# EAGLE design EZLink_SIL_8051_443x (EAGLE 4.16)
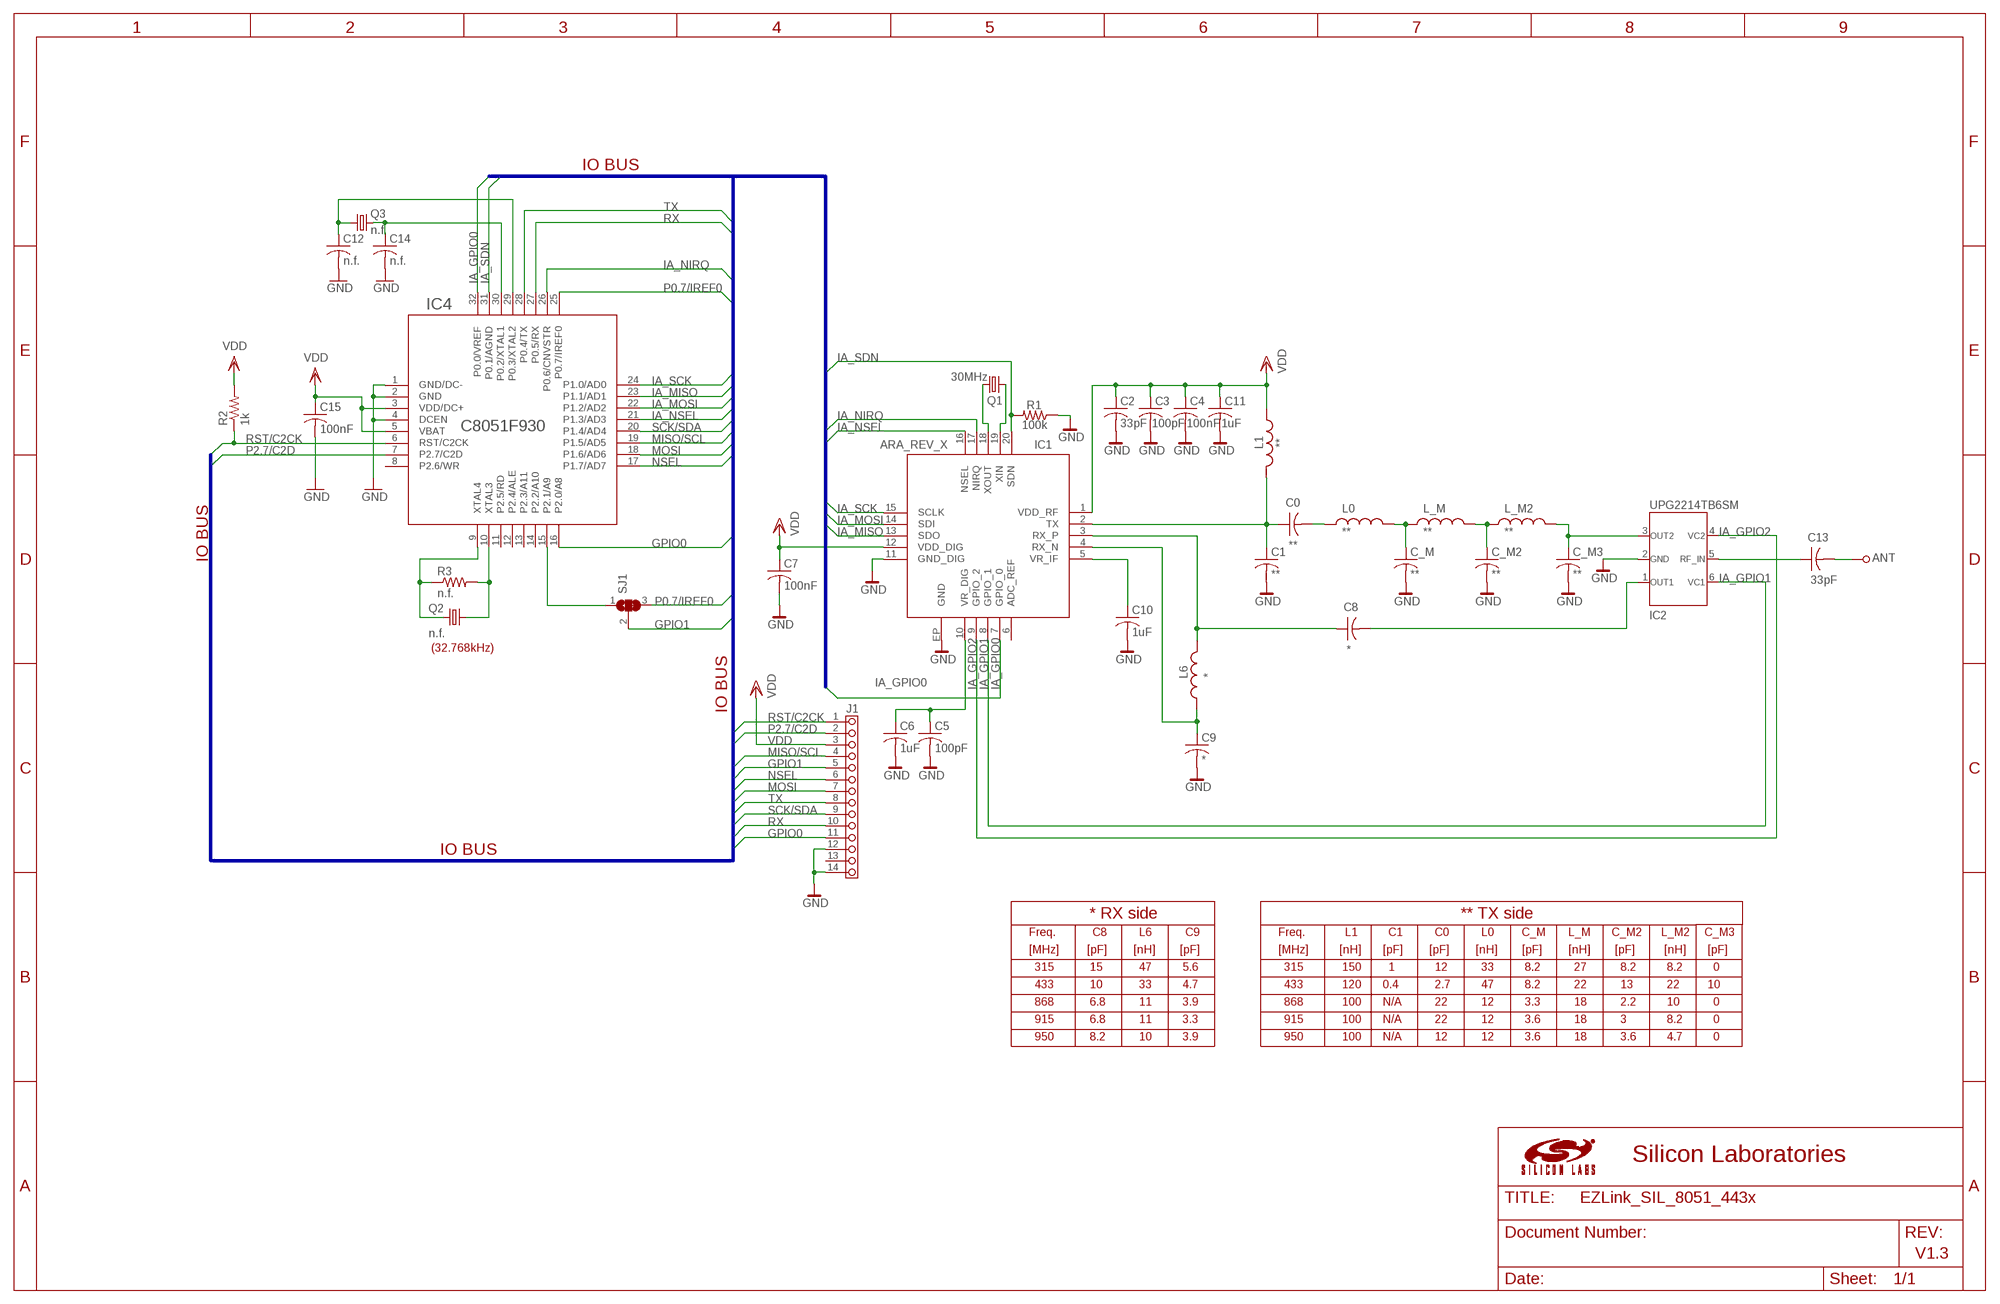
[diagram p0: schematic, sheet 1]

## Parts
ANT  TESTPOINT32MIL  [TESTPOINT0,8]
C0  **  C-US-SMD0402  [0402]
C1  **  C-US-SMD0402  [0402]
C2  33pF  C-USC0603K  [C0603K]
C3  100pF  C-USC0603K  [C0603K]
C4  100nF  C-USC0603K  [C0603K]
C5  100pF  C-USC0603K  [C0603K]
C6  1uF  C-USC0603K  [C0603K]
C7  100nF  C-USC0603K  [C0603K]
C8  *  C-US-SMD0402  [0402]
C9  *  C-US-SMD0402  [0402]
C10  1uF  C-USC0603K  [C0603K]
C11  1uF  C-USC0603K  [C0603K]
C12  n.f.  C-USC0603K  [C0603K]
C13  33pF  C-US-SMD0402  [0402]
C14  n.f.  C-USC0603K  [C0603K]
C15  100nF  C-USC0603K  [C0603K]
C_M  **  C-US-SMD0402  [0402]
C_M2  **  C-US-SMD0402  [0402]
C_M3  **  C-US-SMD0402  [0402]
IC1  ARA_REV_X  [QFN-20]
IC2  UPG2214TB6SM  [6-PIN_SUPER_MINIMOLD]
IC4  C8051F930  C8051F9309DRILL  [QFN-32-5X5-1]
J1  PIN14S-2MM  [PIN14S_2MM]
L0  **  INDUCTCOILCRAFT-0402  [L1005]
L1  **  INDUCTCOILCRAFT-0603  [L1608]
L6  *  INDUCTCOILCRAFT-0402  [L1005]
L_M  **  INDUCTCOILCRAFT-0402  [L1005]
L_M2  **  INDUCTCOILCRAFT-0402  [L1005]
Q1  30MHz  CRYSTAL-4PINSX-2520-NEW1  [QUARTZ_SIWARD_2520_NEW1]
Q2  n.f.  CRYSTAL32SL  [SMQ32SL]
Q3  n.f.  CRYSTAL-4PINSX-5032_NEW  [QUARTZ_SIWARD_5032_NEW]
R1  100k  R-US_R0603  [R0603]
R2  1k  R-US_R0603  [R0603]
R3  n.f.  R-US_R0603  [R0603]
SJ1  JUMPER_SMD_3A  [JUMPER_SMD_SJ2A]

## Nets
GND: C1.2 C2.2 C3.2 C4.2 C5.2 C6.2 C7.2 C9.2 C10.2 C11.2 C12.2 C14.2 C15.2 C_M2.2 C_M3.2 C_M.2 IC1.11(GND_DIG) IC1.EP(GND) IC2.2 IC4.1(GND/DC-) IC4.2(GND) IC4.4(DCEN) J1.12 J1.14 R1.1
GPIO0: IC4.16(P2.0/A8) J1.11
GPIO1: J1.5 SJ1.2
IA_GPIO0: IC1.7(GPIO_0) IC4.32(P0.0/VREF)
IA_GPIO1: IC1.8(GPIO_1) IC2.6
IA_GPIO2: IC1.9(GPIO_2) IC2.4
IA_MISO: IC1.13(SDO) IC4.23(P1.1/AD1)
IA_MOSI: IC1.14(SDI) IC4.22(P1.2/AD2)
IA_NIRQ: IC1.17(NIRQ) IC4.26(P0.6/CNVSTR)
IA_NSEL: IC1.16(NSEL) IC4.21(P1.3/AD3)
IA_SCK: IC1.15(SCLK) IC4.24(P1.0/AD0)
IA_SDN: IC1.20(SDN) IC4.31(P0.1/AGND) R1.2
MISO/SCL: IC4.19(P1.5/AD5) J1.4
MOSI: IC4.18(P1.6/AD6) J1.7
N$1: IC1.18(XOUT) Q1.1
N$2: C10.1 IC1.5(VR_IF)
N$3: C0.1 C1.1 IC1.2(TX) L1.2
N$4: C0.2 L0.1
N$5: C_M.1 L0.2 L_M.1
N$6: C_M2.1 L_M2.1 L_M.2
N$7: C_M3.1 IC2.3 L_M2.2
N$8: C8.1 IC1.3(RX_P) L6.2
N$9: C9.1 IC1.4(RX_N) L6.1
N$10: C8.2 IC2.1
N$11: C13.1 IC2.5
N$16: C5.1 C6.1 IC1.10(VR_DIG)
N$18: ANT.1 C13.2
N$53: IC4.10(XTAL3) Q2.4 R3.2
N$57: IC4.9(XTAL4) Q2.1 R3.1
N$63: C12.1 IC4.29(P0.3/XTAL2) Q3.1
N$66: C14.1 IC4.30(P0.2/XTAL1) Q3.3
N$67: IC4.15(P2.1/A9) SJ1.1
NSEL: IC4.17(P1.7/AD7) J1.6
P0.7/IREF0: IC4.25(P0.7/IREF0) SJ1.3
P2.7/C2D: IC4.7(P2.7/C2D) J1.2
RST/C2CK: IC4.6(RST/C2CK) J1.1 R2.1
RX: IC4.27(P0.5/RX) J1.10
SCK/SDA: IC4.20(P1.4/AD4) J1.9
TX: IC4.28(P0.4/TX) J1.8
VDD: C2.1 C3.1 C4.1 C7.1 C11.1 C15.1 IC1.1(VDD_RF) IC1.12(VDD_DIG) IC4.3(VDD/DC+) IC4.5(VBAT) J1.3 L1.1 R2.2
XIN: IC1.19(XIN) Q1.3
Unconnected: IC1.6(ADC_REF) IC4.8(P2.6/WR) IC4.11(P2.5/RD) IC4.12(P2.4/ALE) IC4.13(P2.3/A11) IC4.14(P2.2/A10) J1.13

## Buses
RX,TX,GPIO1,GPIO0,NSEL,MOSI,MISO/SCL,SCK/SDA,P0.7/IREF0,RST/C2CK,P2.7/C2D,IA_MOSI,IA_SCK,IA_NSEL,IA_MISO,IA_NIRQ,IA_SDN

## Notes on the sheet
- IO BUS
- IO BUS
- (32.768kHz)
- IO BUS
- IO BUS
- * RX side | ** TX side
- Freq. | C8 | L6 | C9 | Freq. | L1 | C1 | C0 | L0 | C_M | L_M | C_M2 | L_M2 | C_M3
- [MHz] | [pF] | [nH] | [pF] | [MHz] | [nH] | [pF] | [pF] | [nH] | [pF] | [nH] | [pF] | [nH] | [pF]
- 315 | 15 | 47 | 5.6 | 315 | 150 | 1 | 12 | 33 | 8.2 | 27 | 8.2 | 8.2 | 0
- 433 | 10 | 33 | 4.7 | 433 | 120 | 0.4 | 2.7 | 47 | 8.2 | 22 | 13 | 22 | 10
- 868 | 6.8 | 11 | 3.9 | 868 | 100 | N/A | 22 | 12 | 3.3 | 18 | 2.2 | 10 | 0
- 915 | 6.8 | 11 | 3.3 | 915 | 100 | N/A | 22 | 12 | 3.6 | 18 | 3 | 8.2 | 0
- 950 | 8.2 | 10 | 3.9 | 950 | 100 | N/A | 12 | 12 | 3.6 | 18 | 3.6 | 4.7 | 0
- Silicon Laboratories
- V1.3

## Power pins joined to a net without a drawn wire
GND: IC4.EP1(GND) IC4.EP2(GND) IC4.EP3(GND) IC4.EP4(GND) IC4.EP5(GND) IC4.EP6(GND) IC4.EP7(GND) IC4.EP8(GND) IC4.EP(GND) Q1.2(GND) Q1.4(GND) Q3.2(GND) Q3.4(GND)

## Library data of the parts
ANT = lve:TESTPOINT
C0 C1 C8 C9 C13 C_M C_M2 C_M3 = lve:C-US-SMD
C2-C7 C10-C12 C14 C15 = rcl:C-US: CAPACITOR, American symbol
IC1 = lve:ARA_REV_X
IC2 = lve:UPG2214TB
IC4 = lve:C8051F930
J1 = lve:PIN14S
L0 L1 L6 L_M L_M2 = lve:INDUCT
Q1 Q3 = lve:CRYSTAL-4PIN
Q2 = lve:CRYSTAL
R1-R3 = rcl:R-US_: RESISTOR, American symbol
SJ1 = lve:JUMPER_SMD_3A

## Board
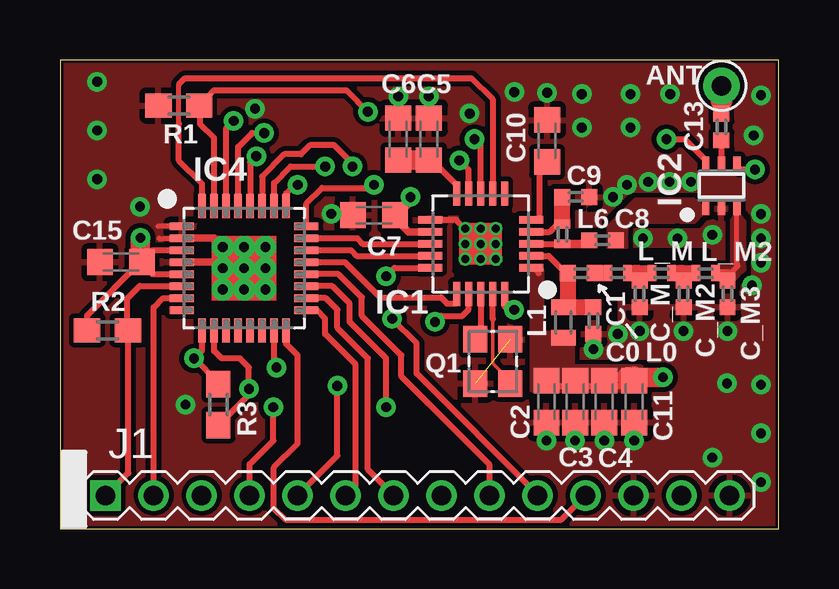
[diagram p1: board, top side]
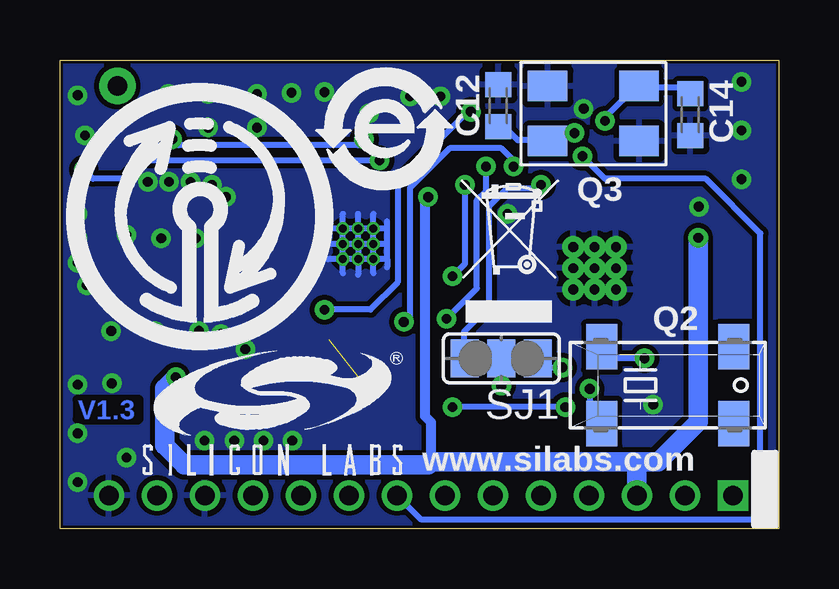
[diagram p2: board, bottom side, seen from below]

Size 29.95 x 19.56 mm. Coordinates in mm from the lower left corner, seen from the top.
Outline: 0,0 29.95,0 29.95,19.56 0,19.56 0,0
Copper layers (1*16): Top 0.035mm / dielectric 1.5mm / Bottom 0.035mm
Design rules "default": minimum track width 8mil, minimum drill 13mil, track to track 8mil, track to pad 8mil, pad to pad 8mil, via to via 8mil, smd to smd 0mil, copper to edge 5mil, drill to drill 8mil, minimum pad ring 4mil, minimum via ring 8mil, stop-mask expansion 4mil, vias tented up to drill 50mil, thermal gap 10mil
tRestrict: 16 lines

### Footprints (pad centres in the part's own frame; a part is rotated, then mirrored left to right if it is on the bottom)
TESTPOINT0,8 = drill 0.813 pad 1.524 round: 1 0,0
0402 = smd 0.66 x 0.66: 1 -0.559,0; 2 0.559,0
C0603K = smd 1.05 x 1.08: 1 -0.875,0; 2 0.875,0
QFN-20 = smd 1 x 0.3: 1 -2.1,1; 2 -2.1,0.5; 3 -2.1,0; 4 -2.1,-0.5; 5 -2.1,-1; 11 2.1,-1; 12 2.1,-0.5; 13 2.1,0; 14 2.1,0.5; 15 2.1,1 | smd 0.3 x 1: 6 -1,-2.1; 7 -0.5,-2.1; 8 0,-2.1; 9 0.5,-2.1; 10 1,-2.1; 16 1,2.1; 17 0.5,2.1; 18 0,2.1; 19 -0.5,2.1; 20 -1,2.1 | drill 0.33 pad 0.508 round: EP 0,0; EP1 -0.635,-0.635; EP2 0,-0.635; EP3 0.635,-0.635; EP4 -0.635,0; EP5 0.635,0; EP7 0,0.635; EP8 0.635,0.635 | drill 0.33 pad 0.508 octagon: EP6 -0.635,0.635
6-PIN_SUPER_MINIMOLD = smd 0.55 x 0.3: 1 -0.948,0.65; 2 -0.948,0; 3 -0.948,-0.65; 4 0.948,-0.65; 5 0.948,0; 6 0.948,0.65
QFN-32-5X5-1 = smd 1 x 0.3: 1 -2.6,1.75; 2 -2.6,1.25; 3 -2.6,0.75; 4 -2.6,0.25; 5 -2.6,-0.25; 6 -2.6,-0.75; 7 -2.6,-1.25; 8 -2.6,-1.75; 17 2.6,-1.75; 18 2.6,-1.25; 19 2.6,-0.75; 20 2.6,-0.25; 21 2.6,0.25; 22 2.6,0.75; 23 2.6,1.25; 24 2.6,1.75 | smd 0.3 x 1: 9 -1.75,-2.6; 10 -1.25,-2.6; 11 -0.75,-2.6; 12 -0.25,-2.6; 13 0.25,-2.6; 14 0.75,-2.6; 15 1.25,-2.6; 16 1.75,-2.6; 25 1.75,2.6; 26 1.25,2.6; 27 0.75,2.6; 28 0.25,2.6; 29 -0.25,2.6; 30 -0.75,2.6; 31 -1.25,2.6; 32 -1.75,2.6 | drill 0.406 pad 0.914 round: EP 0,0; EP1 -0.889,0.889; EP2 0,0.889; EP3 0.889,0.889; EP4 -0.889,0; EP5 0.889,0; EP6 -0.889,-0.889; EP7 0,-0.889; EP8 0.889,-0.889
PIN14S_2MM = drill 0.813 pad 1.27 square: 1 0,0 | drill 0.813 pad 1.27 round: 2 2,0; 3 4,0; 4 6,0; 5 8,0; 6 10,0; 7 12,0; 8 14,0; 9 16,0; 10 18,0; 11 20,0; 12 22,0; 13 24,0; 14 26,0
L1005 = smd 0.356 x 0.66: 1 -0.406,0; 2 0.406,0
L1608 = smd 0.64 x 1.02: 1 -0.64,0; 2 0.64,0
QUARTZ_SIWARD_2520_NEW1 = smd 1.1 x 1: 1 -0.925,-0.725; 2 0.925,-0.725; 3 0.925,0.725; 4 -0.925,0.725
SMQ32SL = smd 1.3 x 1.9: 1 -2.75,1.6; 2 2.75,1.6; 3 2.75,-1.6; 4 -2.75,-1.6
QUARTZ_SIWARD_5032_NEW = smd 1.651 x 1.27: 1 -1.905,-1.143; 2 1.905,-1.143; 3 1.905,1.143; 4 -1.905,1.143
R0603 = smd 1.1 x 1: 1 -0.85,0; 2 0.85,0
JUMPER_SMD_SJ2A = smd 1.168 x 1.6: 1 -1.524,0; 2 0,0; 3 1.524,0

### Placement (x,y rotation side)
ANT  27.56,18.48 0 top
C0  21.72,10.67 0 top
C1  22.23,8.69 270 top
C2  20.27,5.31 270 top
C3  21.46,5.31 270 top
C4  22.68,5.31 270 top
C5  15.37,16.26 90 top
C6  14.1,16.26 90 top
C7  13.08,13.08 180 top
C8  22.61,12.04 0 top
C9  21.49,13.84 0 top
C10  20.29,16.18 90 top
C11  23.93,5.31 270 top
C12  11.68,17.65 90 bottom
C13  27.56,16.76 90 top
C14  3.68,17.27 270 bottom
C15  2.54,11.13 180 top
C_M  24.16,9.8 270 top
C_M2  25.98,9.8 270 top
C_M3  27.81,9.8 270 top
IC1  17.53,11.89 180 top
IC2  27.56,14.31 90 top
IC4  7.67,10.87 0 top
J1  1.91,1.4 0 top
L0  23.24,10.67 0 top
L1  20.98,8.61 90 top
L6  20.93,12.29 270 top
L_M  25.07,10.67 0 top
L_M2  26.9,10.67 0 top
Q1  18.03,6.99 270 top
Q2  4.62,5.99 0 bottom
Q3  7.72,17.32 0 bottom
R1  4.95,17.65 0 top
R2  1.98,8.28 180 top
R3  6.6,5.18 270 top
SJ1  11.56,7.11 180 bottom
U$11  [SILABS_LOGO]  27.43,1.78 0 bottom
U$16  [TRANSCEIVE-ICON06]  24.13,13.34 0 bottom
U$28  [NON-DISPOSABLE]  11.2,12.5 0 bottom
U$31  [ROHS_CHINA]  16.36,16.74 0 bottom

### Tracks (layer width: path | path; a pad name or v marks a point on that pad's centre or on a via)
GND  (via drill 0.41 pad 0.81)  (1 unrouted)
  Top 0.203: 4.93,12.65 4.9,12.62 4.09,12.62 | 4.88,12.14 4.85,12.12 4.12,12.12
  Top 0.254: IC1.EP 17.53,11.87 16.51,12.89 IC1.11
  Top 0.305: IC4.2 6.42,12.12 IC4.EP 7.42,11.12 IC4.4
  Bottom 0.254: 17.53,13.14 IC1.EP 17.53,10.6 | 16.89,10.67 16.89,13.14 | 16.32,12.52 16.32,12.83 | 16.32,11.89 16.32,12.52 | 16.32,11.25 16.32,11.89 | 16.32,11.25 16.32,10.92 | 16.32,12.52 18.75,12.52 | 18.16,10.67 18.16,13.14 | 16.32,11.89 18.76,11.89 | 16.32,11.25 18.77,11.25
  other vias: 25.98,8.26 24.16,8.26 23.24,8.13 23.04,13.84 20.3,18.19 18.93,18.22 22.68,3.68 21.46,3.68 25.73,12.12 29.21,18.08 29.21,11.1 20.27,3.68 24.3,12.12 27.18,12.27 17.07,17.32 25.43,18.14 23.77,18.14 21.74,18.14 21.74,16.74 29.21,13.13 29.21,12.12 28.83,10.16 29.21,6.02 29.21,3.99 29.21,1.96 27.18,2.97 23.93,3.68 23.77,16.74 5.23,5.18 8.13,17.53 28.91,16.41 27.79,6.07 27.81,8.26 1.55,18.65 1.55,16.62 1.55,14.58 3.33,13.44 25.4,14.48 26.29,14.48 24.51,14.48 23.62,14.35 22.23,7.49 11.3,13.14 14.1,18.03 15.37,18.03
  pour Top (rank 2): 0.13,19.56 29.82,19.56 29.82,0 0.13,0
  pour Bottom (rank 2): 0.13,19.56 0.13,0 29.82,0 29.82,19.56
GPIO0
  Top 0.254: IC4.16 9.42,7.72 9.91,7.24 9.91,3.56 8.91,2.56 8.91,0.86 9.4,0.38 20.89,0.38 J1.11
GPIO1  (via drill 0.41 pad 0.81)
  Top 0.254: J1.5 11.56,3.05 v11.56,5.97
  Bottom 0.254: v11.56,5.97 SJ1.2
IA_GPIO0
  Top 0.203: 4.95,16.89 4.95,18.54
  Top 0.254: 4.95,18.54 5.21,18.8 17.14,18.8 18.03,17.91 IC1.7 | 4.95,16.89 4.95,15.37 5.92,14.4 IC4.32
IA_GPIO1  (via drill 0.41 pad 0.81)
  Top 0.254: IC2.6 26.91,15.38 26.04,16.26 v25.27,16.26 | IC1.8 17.53,16 v17.27,16.26
  Bottom 0.254: v17.27,16.26 17.53,16 25.02,16 v25.27,16.26
IA_GPIO2  (via drill 0.41 pad 0.81)
  Top 0.254: IC2.4 28.21,15.1 28.32,14.99 v28.96,14.99 | IC1.9 17.03,14.98 v16.64,15.37
  Bottom 0.254: v16.64,15.37 26.54,15.37 27.3,14.61 28.57,14.61 v28.96,14.99
IA_MISO
  Top 0.254: IC4.23 12.39,12.12 12.62,11.89 IC1.13
IA_MOSI
  Top 0.254: IC4.22 12.13,11.62 12.36,11.39 IC1.14
IA_NIRQ  (via drill 0.41, 0.41 pad 0.81)
  Top 0.254: v15.62,8.64 15.88,8.89 16.76,8.89 17.03,9.15 IC1.17 | IC4.26 8.92,14.43 9.6,15.11 v11.05,15.11
  Bottom 0.254: v11.05,15.11 11.05,15.37 11.56,15.88 13.72,15.88 15.37,14.22 15.37,8.89 v15.62,8.64
IA_NSEL
  Top 0.254: IC4.21 11.87,11.12 13.34,9.65 15.88,9.65 16.13,9.4 16.53,9.4 IC1.16
IA_SCK  (via drill 0.41 pad 0.81)
  Top 0.254: IC1.15 13.94,10.89 v13.59,10.54 | v13.08,14.35 12.95,14.22 10.92,14.22 10.27,13.57 IC4.24
  Bottom 0.254: v13.08,14.35 13.08,11.05 v13.59,10.54
IA_SDN  (via drill 0.41 pad 0.81)
  Top 0.254: v12.83,17.4 11.94,18.29 6.41,18.29 R1.2 5.84,17.69 5.84,16.89 6.42,16.31 IC4.31 | v18.92,9.14 18.67,9.14 18.53,9.29 IC1.20
  Bottom 0.254: v18.92,9.14 17.02,9.14 15.88,10.29 15.88,14.48 12.95,17.4 v12.83,17.4
MISO/SCL  (via drill 0.41 pad 0.81)
  Top 0.254: IC4.19 11.34,10.12 12.06,9.4 12.06,8.64 13.59,7.11 v13.59,5.08 | v8.89,5.08 8.89,3.68 7.91,2.7 J1.4
  Bottom 0.254: v8.89,5.08 v13.59,5.08
MOSI
  Top 0.254: IC4.18 11.08,9.62 11.56,9.14 11.56,8.38 12.83,7.11 12.83,2.48 J1.7
N$1
  Top 0.254: Q1.1 17.31,7.96 17.27,8 17.53,8.26 IC1.18
  Top 0.305: Q1.1 17.53,7.91
N$2
  Top 0.254: C10.1 19.99,15.33 19.99,12.89 IC1.5
N$3
  Top 0.254: 21.16,9.47 21.16,9.42 L1.2 | IC1.2 20.36,11.39 21.08,10.67
  Top 0.305: 21.08,10.67 C0.1
  Top 0.66: C0.1 21.16,9.47 | L1.2 20.95,9.27 | L1.2 | C1.1 L1.2
N$4
  Top 0.254: 22.61,10.67 L0.1
  Top 0.66: C0.2 22.61,10.67
N$5
  Top 0.254: 23.88,10.67 L0.2 | 24.38,10.67 L_M.1
  Top 0.66: 24.16,10.67 23.88,10.67 | C_M.1 24.16,10.67 | 24.16,10.67 24.38,10.67
N$6
  Top 0.254: 25.76,10.67 L_M.2 | 26.24,10.67 L_M2.1
  Top 0.66: 25.98,10.67 25.76,10.67 | C_M2.1 25.98,10.67 | 25.98,10.67 26.24,10.67
N$7
  Top 0.203: 27.81,10.67 27.94,10.67 28.25,10.98 28.19,11.04 28.19,13.22
  Top 0.305: L_M2.2 27.81,10.67 C_M3.1
  pour Top (no thermals): 27.93,10.99 27.46,10.99 27.46,10.35 28.14,10.35 28.59,10.79 28.59,12.81 28.35,13.13 28.09,13.13 27.93,12.89
N$8
  Top 0.254: 21.84,11.96 21.92,12.04 C8.1 | IC1.3 L6.2
  Top 0.356: L6.2 21.77,11.89 21.84,11.96
N$9
  Top 0.254: L6.1 20.93,12.88 | IC1.4 20.41,12.39 20.73,12.7
  Top 0.305: 20.73,12.7 L6.1
  Top 0.66: 20.93,12.88 C9.1
N$10
  pour Top (no thermals): 23.67,12.75 26.47,12.75 26.8,13.11 26.8,13.49 26.43,13.79 23.95,13.79 22.78,12.62 22.78,11.72 23.67,11.72
N$11
  Top 0.254: C13.1 IC2.5
N$16
  Top 0.254: IC1.10 16.53,14.34 15.48,15.38
  Top 0.305: 15.48,15.38 C5.1
  Top 0.813: C5.1 15.37,15.37 15.35,15.38 C6.1
N$18
  Top 0.254: C13.2 27.56,17.88
  Top 0.914: ANT.1 27.56,17.88 27.56,17.87
N$53  (via drill 0.41 pad 0.81)
  Top 0.254: IC4.10 6.42,7.42 6.73,7.11 7.49,7.11 7.87,6.73 v7.87,5.84 7.87,5.59 7,4.71 R3.2
  Bottom 0.254: Q2.4 7.57,4.39 7.87,4.7 v7.87,5.84
N$57  (via drill 0.41 pad 0.81)
  Top 0.254: IC4.9 5.92,7.45 v5.59,7.11 6.6,6.1 R3.1
  Bottom 0.254: Q2.1 7.37,7.5 6.99,7.11 v5.59,7.11
N$63  (via drill 0.41 pad 0.81)
  Top 0.254: IC4.29 7.42,15.93 8,16.51 v8.51,16.51
  Bottom 0.254: 9.65,16.2 Q3.1 9.47,16.18 9.14,16.51 v8.51,16.51 | 9.65,16.2 9.69,15.81 | C12.1 11.44,16.78 10.87,16.2 9.65,16.2
N$66  (via drill 0.41 pad 0.81)
  Top 0.254: IC4.30 6.92,16.7 v7.24,17.02
  Bottom 0.254: Q3.3 5.78,18.43 3.95,18.43 3.68,18.16 C14.1 | Q3.3 5.79,18.49 | Q3.3 5.82,18.52 5.84,18.54 7.24,17.14 v7.24,17.02
N$67  (via drill 0.41 pad 0.81)
  Top 0.254: IC4.15 8.92,6.83 v9.02,6.73
  Bottom 0.254: 9.4,6.73 v9.02,6.73 10.03,6.73 SJ1.1
NSEL
  Top 0.254: IC4.17 10.69,9.12 11.05,8.76 11.05,8.13 12.32,6.86 12.32,1.81 J1.6
P0.7/IREF0  (via drill 0.41 pad 0.81)
  Top 0.254: v9.91,14.35 9.78,14.35 9.42,13.99 IC4.25
  Bottom 0.254: v9.91,14.35 10.03,14.22 11.3,14.22 12.06,13.46 12.06,9.27 13.11,8.23 13.11,7.11 SJ1.3
P2.7/C2D
  Top 0.254: IC4.7 4.29,9.62 3.9,9.24 J1.2
RST/C2CK
  Top 0.254: IC4.6 5.08,10.13 3.33,10.13 2.79,9.6 2.79,8.33 2.85,8.28 | 2.85,8.28 R2.1 | 2.85,8.28 2.85,2.34 J1.1
RX  (via drill 0.41 pad 0.81)
  Top 0.254: IC4.27 8.42,14.7 9.35,15.62 10.03,15.62 10.41,16 11.43,16 12.19,15.24 v12.19,15.11 | v13.84,8.76 14.86,7.75 14.86,6.48 19.91,1.43 J1.10
  Bottom 0.254: v12.19,15.11 12.19,14.1 12.57,13.72 12.57,10.03 v13.84,8.76
SCK/SDA
  Top 0.254: IC4.20 11.6,10.62 12.57,9.65 12.57,8.89 14.22,7.24 14.22,6.35 17.91,2.67 J1.9
TX  (via drill 0.41 pad 0.81)
  Top 0.254: IC4.28 7.92,15.29 v8.18,15.54
  Bottom 0.254: J1.8 14.89,0.38 1.02,0.38 0.76,0.64 0.76,12.32 3.05,14.61 7.24,14.61 v8.18,15.54
VDD  (via drill 0.41, 0.41 pad 0.81)
  Top 0.254: 20.32,6.33 20.32,6.34 C2.1 19.96,5.94 21.16,5.94 | 21.16,5.94 21.36,5.94 21.36,6.34 C3.1 21.16,5.94 | 22.38,5.94 C4.1 | 22.38,5.94 21.16,5.94 | 22.38,5.94 23.9,5.94 23.9,6.34 C11.1 | 3.39,11.16 3.85,11.62 | R2.2 1.12,8.28 1.12,8.89 3.35,11.12 3.37,11.14 3.39,11.14 | IC1.1 19.72,10.89 19.94,10.67 | 3.39,11.14 3.39,11.16 | 3.39,11.14 3.4,11.12 | IC4.3 3.87,11.62 3.43,11.18 | IC4.5 3.86,10.62 3.42,11.06 C15.1 3.42,11.16 | 3.43,11.18 3.42,11.16 | 3.39,11.16 3.42,11.16 | 3.42,11.16 3.43,11.18 | C7.1 13.97,12.95
  Top 0.305: IC1.12 14.54,12.39 13.97,12.95
  Top 0.406: C7.1 14.61,13.72 v14.61,13.84
  Top 0.813: 23.6,6.33 23.61,6.34 C11.1 23.88,6.35 23.9,6.38 23.95,6.33 v25.12,6.33 | v3.35,12.14 3.35,11.12
  Bottom 0.406: 14.48,2.79 14.48,4.45 14.73,4.7 14.73,13.72 v14.61,13.84
  Bottom 0.813: v25.12,6.33 25.58,5.87 25.58,3.48 24.77,2.67 14.61,2.67 14.48,2.79 5.84,2.79 | 5.84,2.79 5.03,2.79 3.35,4.47 v3.35,12.14 | J1.3 5.91,2.73 5.84,2.79
  pour Top (no thermals): 19.68,10.79 19.68,5.82 24.21,5.82 24.21,6.73 21.34,6.73 21.34,8.13 20.07,8.13 20.07,10.79
XIN
  Top 0.025: 18.78,6.06 18.8,6.04
  Top 0.152: 18.69,6.25 18.03,6.91 18.03,8.76 | 18.76,6.16 18.76,6.19
  Top 0.203: 18.76,6.19 18.77,6.2 | 18.76,6.19 | 18.76,6.19 18.8,6.22 | 18.69,6.25 18.75,6.25 18.76,6.24 18.76,6.16 | 18.76,6.16 18.75,6.15 | Q1.3 18.78,6.06 | 18.76,6.16 18.76,6.08 18.8,6.04
  Top 0.254: IC1.19 18.03,8.77 18.03,8.76

### Text on the board
Bottom: V1.3
bPlace: www.silabs.com